# EAGLE design aixplorer_lpc111x (EAGLE 6.3)
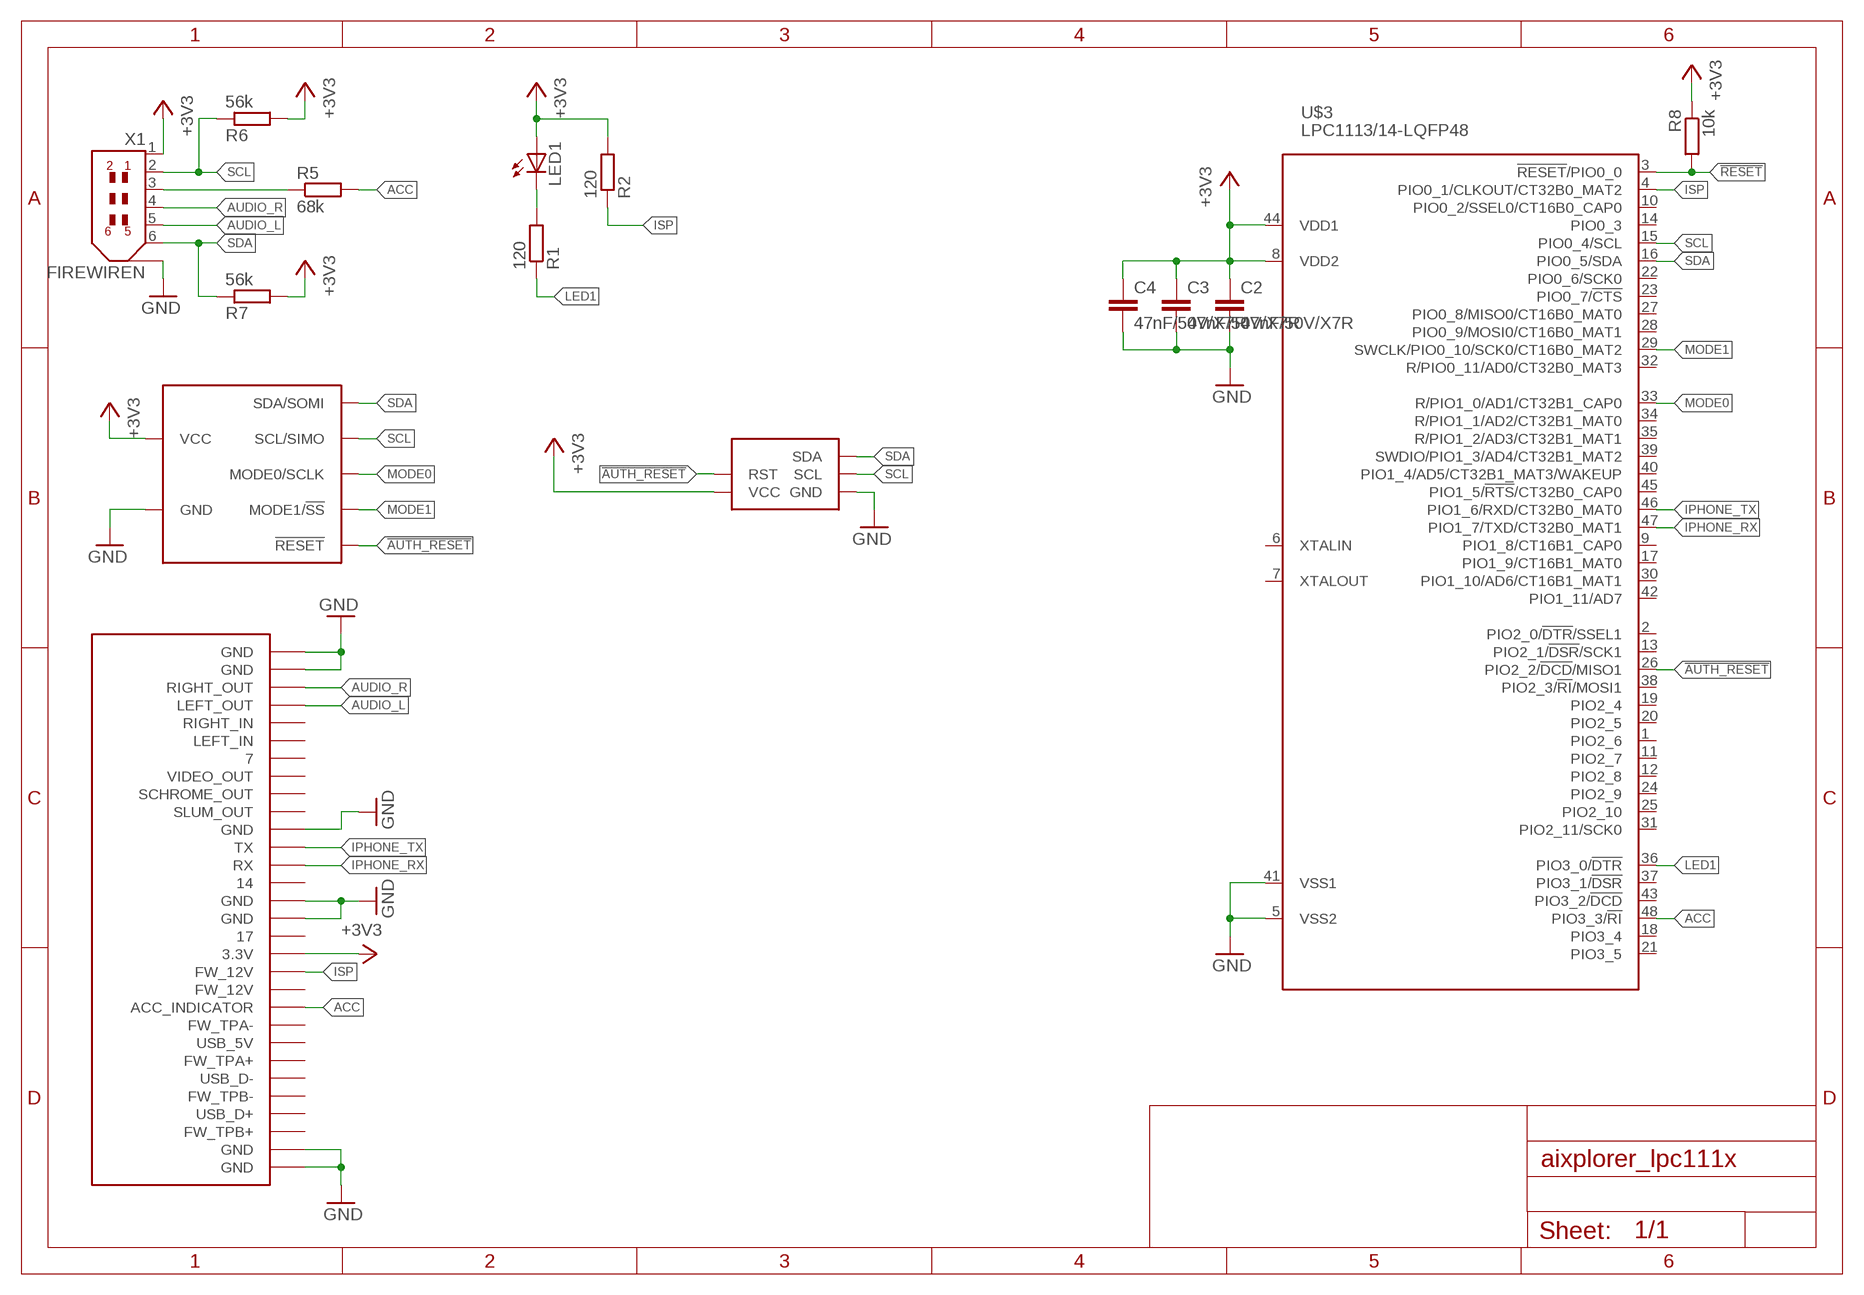
[diagram p0: schematic, sheet 1]

## Parts
C2  47nF/50V/X7R  C-EUC0603K  [C0603K]
C3  47nF/50V/X7R  C-EUC0603K  [C0603K]
C4  47nF/50V/X7R  C-EUC0603K  [C0603K]
LED1  LEDCHIPLED_0805  [CHIPLED_0805]
R1  120  R-EU_R0603  [R0603]
R2  120  R-EU_R0603  [R0603]
R5  68k  R-EU_R0603  [R0603]
R6  56k  R-EU_R0603  [R0603]
R7  56k  R-EU_R0603  [R0603]
R8  10k  R-EU_R0603  [R0603]
U$1  IPAD_CONNECTOR_MALE  [IPOD_CONNECTOR_MALE]
U$2  AUTHENTICATORQFN  [AUTH_QFN20]
U$3  LPC1113/14-LQFP48  [LQFP48]
U$4  AUTHENTICATOR_2C  [AUTH_SQC]
X1  FIREWIREN  [IEEE1394_90DEG_PINS_NORMAL]

## Nets
!AUTH_RESET: U$2.P$4(!RESET) U$3.26(PIO2_2/!DCD!/MISO1) U$4.P$7(RST)
!RESET: R8.2 U$3.3(!RESET!/PIO0_0)
+3V3: C2.1 C3.1 C4.1 LED1.A R2.2 R6.2 R7.2 R8.1 U$1.P$18(3.3V) U$2.P$5(VCC) U$3.8(VDD2) U$3.44(VDD1) U$4.P$8(VCC) X1.1
ACC: R5.2 U$1.P$21(ACC_INDICATOR) U$3.48(PIO3_3/!RI!)
AUDIO_L: U$1.P$4(LEFT_OUT) X1.5
AUDIO_R: U$1.P$3(RIGHT_OUT) X1.4
GND: C2.2 C3.2 C4.2 U$1.P$1(GND) U$1.P$2(GND) U$1.P$11(GND) U$1.P$15(GND) U$1.P$16(GND) U$1.P$29(GND) U$1.P$30(GND) U$2.P$11(GND) U$3.5(VSS2) U$3.41(VSS1) U$4.P$1(GND) X1.M1 X1.M2
IPHONE_RX: U$1.P$13(RX) U$3.47(PIO1_7/TXD/CT32B0_MAT1)
IPHONE_TX: U$1.P$12(TX) U$3.46(PIO1_6/RXD/CT32B0_MAT0)
ISP: R2.1 U$1.P$19(FW_12V) U$3.4(PIO0_1/CLKOUT/CT32B0_MAT2)
LED1: R1.1 U$3.36(PIO3_0/!DTR!)
MODE0: U$2.P$14(MODE0/SCLK) U$3.33(R/PIO1_0/AD1/CT32B1_CAP0)
MODE1: U$2.P$2(MODE1/!SS) U$3.29(SWCLK/PIO0_10/SCK0/CT16B0_MAT2)
N$1: LED1.C R1.2
SCL: R6.1 U$2.P$12(SCL/SIMO) U$3.15(PIO0_4/SCL) U$4.P$6(SCL) X1.2
SDA: R7.1 U$2.P$13(SDA/SOMI) U$3.16(PIO0_5/SDA) U$4.P$2(SDA) X1.6
STUFF: R5.1 X1.3
Unconnected: U$1.P$5(RIGHT_IN) U$1.P$6(LEFT_IN) U$1.P$7 U$1.P$8(VIDEO_OUT) U$1.P$9(SCHROME_OUT) U$1.P$10(SLUM_OUT) U$1.P$14 U$1.P$17 U$1.P$20(FW_12V) U$1.P$22(FW_TPA-) U$1.P$23(USB_5V) U$1.P$24(FW_TPA+) U$1.P$25(USB_D-) U$1.P$26(FW_TPB-) U$1.P$27(USB_D+) U$1.P$28(FW_TPB+) U$3.1(PIO2_6) U$3.2(PIO2_0/!DTR!/SSEL1) U$3.6(XTALIN) U$3.7(XTALOUT) U$3.9(PIO1_8/CT16B1_CAP0) U$3.10(PIO0_2/SSEL0/CT16B0_CAP0) U$3.11(PIO2_7) U$3.12(PIO2_8) U$3.13(PIO2_1/!DSR!/SCK1) U$3.14(PIO0_3) U$3.17(PIO1_9/CT16B1_MAT0) U$3.18(PIO3_4) U$3.19(PIO2_4) U$3.20(PIO2_5) U$3.21(PIO3_5) U$3.22(PIO0_6/SCK0) U$3.23(PIO0_7/!CTS!) U$3.24(PIO2_9) U$3.25(PIO2_10) U$3.27(PIO0_8/MISO0/CT16B0_MAT0) U$3.28(PIO0_9/MOSI0/CT16B0_MAT1) U$3.30(PIO1_10/AD6/CT16B1_MAT1) U$3.31(PIO2_11/SCK0) U$3.32(R/PIO0_11/AD0/CT32B0_MAT3) U$3.34(R/PIO1_1/AD2/CT32B1_MAT0) U$3.35(R/PIO1_2/AD3/CT32B1_MAT1) U$3.37(PIO3_1/!DSR!) U$3.38(PIO2_3/!RI!/MOSI1) U$3.39(SWDIO/PIO1_3/AD4/CT32B1_MAT2) U$3.40(PIO1_4/AD5/CT32B1_MAT3/WAKEUP) U$3.42(PIO1_11/AD7) U$3.43(PIO3_2/!DCD!) U$3.45(PIO1_5/!RTS!/CT32B0_CAP0)

## Library data of the parts
C2-C4 = rcl:C-EU: CAPACITOR, European symbol
LED1 = led:LED: LED OSRAM: - CHIPLED LG R971, LG N971, LY N971, LG Q971, LY Q971, LO R971, LY R971 LH N974, LH R974 LS Q976, LO Q976, LY Q976 LO Q996 - Hyper CHIPLED LW Q18S LB Q993, LB Q99A, LB R99A - SideLED LS A670, LO A670, LY A670, LG A670, LP A670 LB A673, LV A673, LT A673, LW A673 LH A674 LY A675 LS A676, LA A676, LO A676, LY A676, LW A676 LS A679, LY A679, LG A679 - Hyper Micro SIDELED® LS Y876, LA Y876, LO Y876, LY Y876 LT Y87S - SmartLED LW L88C, LW L88S LB L89C, LB L89S, LG L890 LS L89K, LO L89K, LY L89K LS L896, LA L896, LO L896, LY L896 - TOPLED LS T670, LO T670, LY T670, LG T670, LP T670 LSG T670, LSP T670, LSY T670, LOP T670, LYG T670 LG T671, LOG T671, LSG T671 LB T673, LV T673, LT T673, LW T673 LH T674 LS T676, LA T676, LO T676, LY T676, LB T676, LH T676, LSB T676, LW T676 LB T67C, LV T67C, LT T67C, LS T67K, LO T67K, LY T67K, LW E67C LS E67B, LA E67B, LO E67B, LY E67B, LB E67C, LV E67C, LT E67C LW T67C LS T679, LY T679, LG T679 LS T770, LO T770, LY T770, LG T770, LP T770 LB T773, LV T773, LT T773, LW T773 LH T774 LS E675, LA E675, LY E675, LS T675 LS T776, LA T776, LO T776, LY T776, LB T776 LHGB T686 LT T68C, LB T68C - Hyper Mini TOPLED® LB M676 - Mini TOPLED Santana® LG M470 LS M47K, LO M47K, LY M47K Source: http://www.osram.convergy.de LUXEON: - LUMILED® LXK2-PW12-R00, LXK2-PW12-S00, LXK2-PW14-U00, LXK2-PW14-V00 LXK2-PM12-R00, LXK2-PM12-S00, LXK2-PM14-U00 LXK2-PE12-Q00, LXK2-PE12-R00, LXK2-PE12-S00, LXK2-PE14-T00, LXK2-PE14-U00 LXK2-PB12-K00, LXK2-PB12-L00, LXK2-PB12-M00, LXK2-PB14-N00, LXK2-PB14-P00, LXK2-PB14-Q00 LXK2-PR12-L00, LXK2-PR12-M00, LXK2-PR14-Q00, LXK2-PR14-R00 LXK2-PD12-Q00, LXK2-PD12-R00, LXK2-PD12-S00 LXK2-PH12-R00, LXK2-PH12-S00 LXK2-PL12-P00, LXK2-PL12-Q00, LXK2-PL12-R00 Source: www.luxeon.com KINGBRIGHT: KA-3528ASYC Source: www.kingbright.com
R1 R2 R5-R8 = rcl:R-EU_: RESISTOR, European symbol
U$1 = corona:IPAD_CONNECTOR_MALE
U$2 = corona:AUTHENTICATOR
U$3 = lpc1100v1.1:LPC1113/14-LQFP48: NXP Semiconductors LPC11xx microcontrollers <http://ics.nxp.com/products/lpc1000/lpc11xx/> ARM 32-bit Cortex-M0 Microcontroller with MPU CPU clock up to 50MHz Up to 32KByte on-chip Flash ROM with In-System Programming (ISP) and In-Application Programming (IAP) via On-Chip Bootloader Up to 8KByte SRAM Nested Vectored Interrupt Controller Up to 2 SPI controllers UART with full Modem Interface and RS485 Support Fast Mode I2C-Bus 4 Timers with 4 capture channels and 13 output channels Watchdog (WDT) Sytem tick timer 10-bit ADC with 8 channels Power Management Unit (PMU) Brownout detection 12MHz internal RC oscillator Serial Wire Debug/Trace port
U$4 = corona:AUTHENTICATOR_2C
X1 = corona:FIREWIRE

## Board
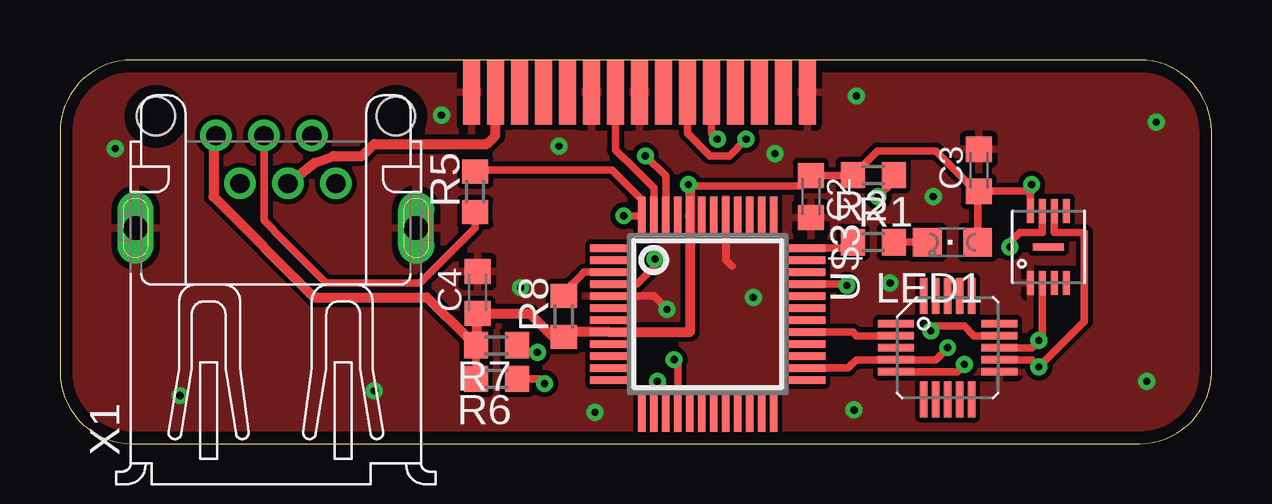
[diagram p1: board, top side]
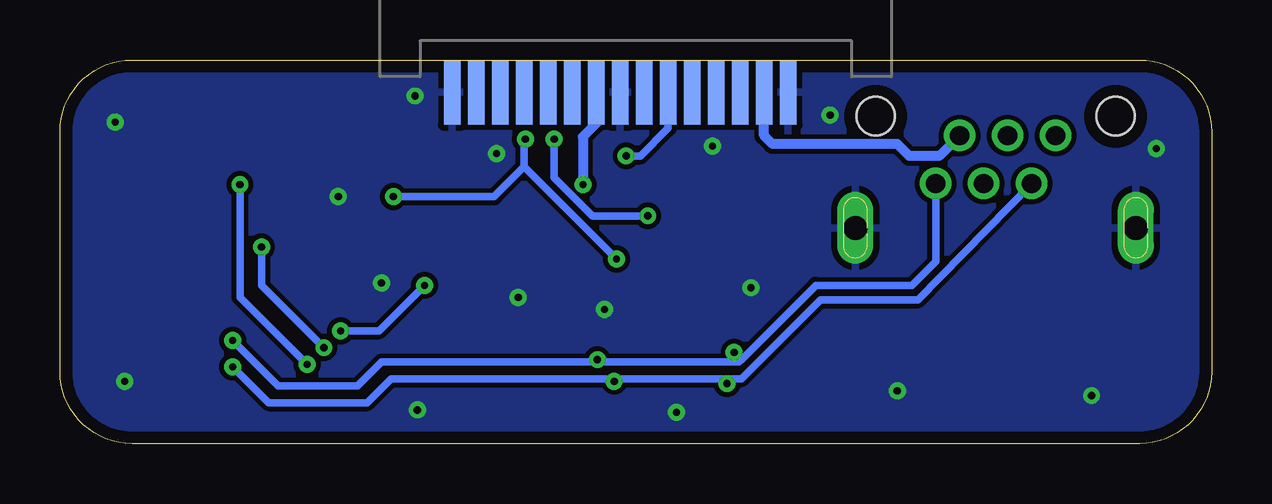
[diagram p2: board, bottom side, seen from below]

Size 48 x 16 mm. Coordinates in mm from the lower left corner, seen from the top.
Outline: 48,6 48,13 arc90 45,16 3,16 arc90 0,13 0,3 arc90 3,0 45,0 arc90 48,3 48,6
Copper layers (1*16): Top 0.035mm / dielectric 1.5mm / Bottom 0.035mm
Design rules "default *": minimum track width 10mil, minimum drill 24mil, track to track 8mil, track to pad 8mil, pad to pad 8mil, via to via 8mil, smd to smd 8mil, copper to edge 20mil, drill to drill 8mil, minimum pad ring 10mil, minimum via ring 8mil, stop-mask expansion 4mil, vias tented up to drill 12mil, thermal gap 10mil

### Footprints (pad centres in the part's own frame; a part is rotated, then mirrored left to right if it is on the bottom)
C0603K = smd 1.05 x 1.08: 1 -0.875,0; 2 0.875,0
CHIPLED_0805 = smd 1.2 x 1.2: A 0,-1.05; C 0,1.05
R0603 = smd 1 x 1.1: 1 -0.85,0; 2 0.85,0
IPOD_CONNECTOR_MALE = smd 0.7 x 2.7 bottom: P$1 6.85,-1.35; P$3 5.85,-1.35; P$5 4.85,-1.35; P$7 3.85,-1.35; P$9 2.85,-1.35; P$11 1.85,-1.35; P$13 0.85,-1.35; P$15 -0.15,-1.35; P$17 -1.15,-1.35; P$19 -2.15,-1.35; P$21 -3.15,-1.35; P$23 -4.15,-1.35; P$25 -5.15,-1.35; P$27 -6.15,-1.35; P$29 -7.15,-1.35 | smd 0.7 x 2.7: P$2 6.35,-1.35; P$4 5.35,-1.35; P$6 4.35,-1.35; P$8 3.35,-1.35; P$10 2.35,-1.35; P$12 1.35,-1.35; P$14 0.35,-1.35; P$16 -0.65,-1.35; P$18 -1.65,-1.35; P$20 -2.65,-1.35; P$22 -3.65,-1.35; P$24 -4.65,-1.35; P$26 -5.65,-1.35; P$28 -6.65,-1.35; P$30 -7.65,-1.35
AUTH_QFN20 = smd 0.3 x 1.5: P$1 -1,-2.15; P$2 -0.5,-2.15; P$3 0,-2.15; P$4 0.5,-2.15; P$5 1,-2.15; P$11 1,2.15; P$12 0.5,2.15; P$13 0,2.15; P$14 -0.5,2.15; P$15 -1,2.15 | smd 1.5 x 0.3: P$6 2.15,-1; P$7 2.15,-0.5; P$8 2.15,0; P$9 2.15,0.5; P$10 2.15,1; P$16 -2.15,1; P$17 -2.15,0.5; P$18 -2.15,0; P$19 -2.15,-0.5; P$20 -2.15,-1
LQFP48 = smd 0.3 x 1.6: 1 -2.75,-4.1; 2 -2.25,-4.1; 3 -1.75,-4.1; 4 -1.25,-4.1; 5 -0.75,-4.1; 6 -0.25,-4.1; 7 0.25,-4.1; 8 0.75,-4.1; 9 1.25,-4.1; 10 1.75,-4.1; 11 2.25,-4.1; 12 2.75,-4.1; 25 2.75,4.1; 26 2.25,4.1; 27 1.75,4.1; 28 1.25,4.1; 29 0.75,4.1; 30 0.25,4.1; 31 -0.25,4.1; 32 -0.75,4.1; 33 -1.25,4.1; 34 -1.75,4.1; 35 -2.25,4.1; 36 -2.75,4.1 | smd 1.6 x 0.3: 13 4.1,-2.75; 14 4.1,-2.25; 15 4.1,-1.75; 16 4.1,-1.25; 17 4.1,-0.75; 18 4.1,-0.25; 19 4.1,0.25; 20 4.1,0.75; 21 4.1,1.25; 22 4.1,1.75; 23 4.1,2.25; 24 4.1,2.75; 37 -4.1,2.75; 38 -4.1,2.25; 39 -4.1,1.75; 40 -4.1,1.25; 41 -4.1,0.75; 42 -4.1,0.25; 43 -4.1,-0.25; 44 -4.1,-0.75; 45 -4.1,-1.25; 46 -4.1,-1.75; 47 -4.1,-2.25; 48 -4.1,-2.75
AUTH_SQC = smd 0.3 x 1: P$1 -0.75,-1.5; P$2 -0.25,-1.5; P$3 0.25,-1.5; P$4 0.75,-1.5; P$5 0.75,1.5; P$6 0.25,1.5; P$7 -0.25,1.5; P$8 -0.75,1.5 | smd 1.3 x 0.3: P$9 0,0
IEEE1394_90DEG_PINS_NORMAL = drill 0.8 pad 1.27: 1 -2.5,3.85; 2 -1.5,1.85; 3 -0.5,3.85; 4 0.5,1.85; 5 1.5,3.85; 6 2.5,1.85 | drill 1 pad 1.422 long: M1 -5.85,0; M2 5.85,0 | hole 1.6: -5,4.65; 5,4.65

### Placement (x,y rotation side)
C2  31.3,10.3 270 top
C3  38.3,11.4 90 top
C4  17.4,6.3 90 top
LED1  37.2,8.4 90 top
R1  33.9,8.4 0 top
R2  33.9,11.2 180 top
R5  17.3,10.5 90 top
R6  18.2,2.7 180 top
R7  18.2,4.1 180 top
R8  21,5.3 90 top
U$1  24,16 0 bottom
U$2  37,4 270 top
U$3  27,5.4 270 top
U$4  41.2,8.2 0 top
X1  9,9 0 top

### Tracks (layer width: path | path; a pad name or v marks a point on that pad's centre or on a via)
!AUTH_RESET  (via drill 0.3)
  Top 0.305: U$3.26 32.85,3.15 33.2,3.5 U$2.P$4 36.5,3.5 v37,4 | U$4.P$7 40.95,8.8 40,8.8 39.6,8.4 v39.6,8.2
  Bottom 0.305: v39.6,8.2 39.6,6.6 v37,4
!RESET
  Top 0.305: R8.2 21.1,6.4 21.7,7 21.85,7.15 U$3.3
+3V3  (via drill 0.3)
  Top 0.305: R6.2 R7.2 | 21.3,4.65 R8.1 | v26.2,10.8 26.25,10.75 30.88,10.75 C2.1 33.05,11.18 | 33.05,11.18 R2.2 | LED1.A 38.25,10.47 C3.1 | C3.1 40.5,10.53 | 40.5,10.53 40.45,10.53 U$4.P$8 | U$2.P$5 37.4,3 v37.7,3.3 | v40.5,10.8 40.5,10.53 | 33.05,11.18 34.08,12.2 36.5,12.2 38.17,10.53 C3.1
  Top 0.406: X1.1 6.4,12.65 6.4,10.3 10.6,6.1 15.3,6.1 17,4.4 | R8.1 20.95,4.5 20.5,4.5 19.57,5.42 C4.1 17.38,4.4 17,4.4 | 21.3,4.65 U$3.8 24.25,4.65 25.75,4.65 26.25,4.65 U$3.44 26.25,10.75 | R7.2 17.35,4.05 17,4.4
  Bottom 0.305: v37.7,3.3 40.5,6.1 v40.5,10.8
  Bottom 0.406: U$1.P$18 25.65,13.35 26.2,12.8 v26.2,10.8
ACC  (via drill 0.3)
  Top 0.305: R5.2 17.35,11.4 23,11.4 24.25,10.15 U$3.48 v23.5,9.5 | U$1.P$21 27.15,12.95 v27.4,12.7
  Bottom 0.305: v27.4,12.7 27.4,11.1 25.8,9.5 v23.5,9.5
AUDIO_L
  Bottom 0.406: X1.5 11.35,12 12.6,12 13.1,12.5 18.3,12.5 18.65,12.85 U$1.P$4
AUDIO_R
  Top 0.406: X1.4 10.6,11.7 11.4,12 12.6,12 13.1,12.5 17.8,12.5 18.15,12.85 U$1.P$3
GND  (via drill 0.3)
  Top 0.305: U$3.5 24.75,6.15 v25.3,5.6 | U$3.41 27.75,7.65 28,7.4
  other vias: 22.3,1.3 2.3,12.3 5,2 15.9,13.7 13.1,2.2 29.8,12.1 20.8,12.4 33.2,14.5 45.3,2.6 33.1,1.4 45.7,13.4 28.9,6.1 19.2,6.5 34.6,6.7 36.4,10.3
  pour Top: 48,3 48,13 arc90 45,16 3,16 arc90 0,13 0,3 arc90 3,0 45,0 arc90
  pour Bottom: 0,13 0,3 arc90 3,0 45,0 arc90 48,3 48,13 arc90 45,16 3,16 arc90
IPHONE_RX
  Top 0.305: U$1.P$13 23.15,12.25 24,11.4 24.75,10.65 U$3.47
IPHONE_TX  (via drill 0.3)
  Top 0.305: U$3.46 25.25,11.15 v24.4,12
  Bottom 0.305: v24.4,12 23.8,12 22.65,13.15 U$1.P$12
ISP  (via drill 0.3)
  Top 0.305: v24.8,7.7 24.8,7.4 24.1,6.7 24.05,6.65 U$3.4 | R2.1 34.75,10.95 v34.1,10.3 | v28.6,12.7 27.9,12 27.1,12 26.15,12.95 U$1.P$19
  Bottom 0.305: 28.65,11.55 v24.8,7.7 | v34.1,10.3 29.9,10.3 28.65,11.55 | 28.65,11.55 28.65,12.7 v28.6,12.7
LED1
  Top 0.305: U$3.36 32.6,8.15 R1.1
MODE0  (via drill 0.3)
  Top 0.305: U$2.P$14 38.1,4.5 37.7,4.9 36.5,4.9 v36.3,4.7 | v32.8,6.6 32.75,6.65 U$3.33
  Bottom 0.305: v36.3,4.7 34.7,4.7 v32.8,6.6
MODE1
  Top 0.305: U$3.29 33.05,4.65 33.2,4.5 U$2.P$2
N$1
  Top 0.305: R1.2 LED1.C
SCL  (via drill 0.3)
  Top 0.305: U$3.15 25.25,2.25 v24.9,2.6 | v20.2,2.5 20,2.7 19.45,2.7 R6.1 | U$2.P$12 40.5,3.5 v40.8,3.2 42.7,5.1 42.7,8.8 41.45,8.8 U$4.P$6
  Bottom 0.305: 24.9,2.7 v24.9,2.6 24.9,2.7 | 24.9,2.7 20.2,2.7 | 20.2,2.7 19.6,2.7 | 19.6,2.7 16.3,6 12.25,6 X1.2 | 19.6,2.7 20.2,2.7 | 20.2,2.7 v20.2,2.5 | v40.8,3.2 39.3,1.7 35.2,1.7 34.2,2.7 24.9,2.7
SDA  (via drill 0.3)
  Top 0.305: U$3.16 25.75,3.35 v25.6,3.5 | v19.9,3.8 19.3,3.85 R7.1 | U$2.P$13 40.5,4 v40.8,4.3 40.95,4.45 U$4.P$2
  Bottom 0.305: 25.6,3.4 v25.6,3.5 25.6,3.4 | 25.6,3.4 19.7,3.4 19.6,3.5 | 19.6,3.5 16.5,6.6 12.5,6.6 11.5,7.6 X1.6 | v19.9,3.8 19.6,3.5 | v40.8,4.3 38.9,2.4 35.6,2.4 34.6,3.4 25.6,3.4
STUFF
  Top 0.305: X1.3 8.5,9.3 9.3,8.5 11.1,6.7 15,6.7 17.3,9 R5.1